# Altium schematic sheet BOOST.SchDoc
size A4; SheetNumber: 4; SheetTotal: 5
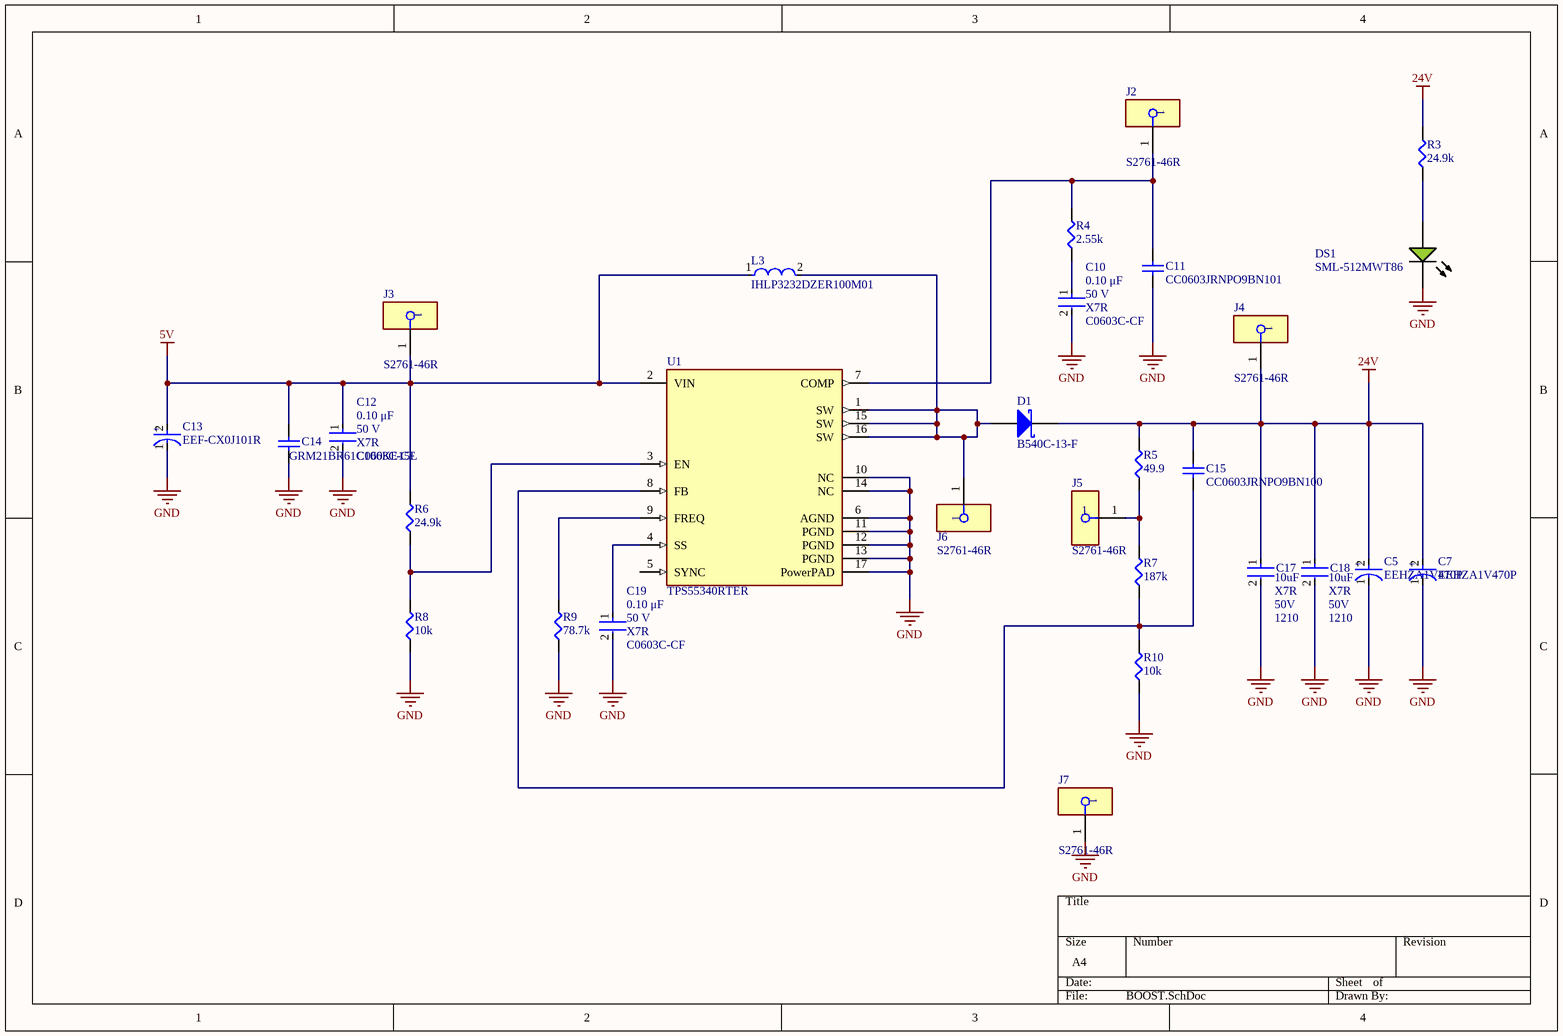
[diagram p0: BOOST.SchDoc]

## Parts
C5  EEHZA1V470P  [FP-EEH-D-MFG]
C7  EEHZA1V470P  [FP-EEH-D-MFG]
C10  value 0.10 μF  Package: C0603C-CF  Voltage Rating: 50 V  Temperature Characteristic: X7R  [FP-C0603C-CF-MFG]  (hidden comment: C0603C104K5RACTU)
C11  CC0603JRNPO9BN101  [CAPC1608X90X40ML10T20]
C12  value 0.10 μF  Package: C0603C-CF  Voltage Rating: 50 V  Temperature Characteristic: X7R  [FP-C0603C-CF-MFG]  (hidden comment: C0603C104K5RACTU)
C13  EEF-CX0J101R  [FP-CX-MFG]
C14  GRM21BR61C106KE15L  [CAPC2013X135X50LL10T20]
C15  CC0603JRNPO9BN100  [CAPC1608X90X40ML10T20]
C17  Capacitance: 10uF  Dielectric: X7R  Voltage Rating (DC): 50V  Case Code (Imperial): 1210  [FP-CL32-IPC_C]  (hidden comment: CL32B106KBJNNNE)
C18  Capacitance: 10uF  Dielectric: X7R  Voltage Rating (DC): 50V  Case Code (Imperial): 1210  [FP-CL32-IPC_C]  (hidden comment: CL32B106KBJNNNE)
C19  value 0.10 μF  Package: C0603C-CF  Voltage Rating: 50 V  Temperature Characteristic: X7R  [FP-C0603C-CF-MFG]  (hidden comment: C0603C104K5RACTU)
D1  B540C-13-F  [DIOD-B5X0C-2_L]
DS1  SML-512MWT86  [ROHM-SML-51X_V]
J2  S2761-46R  [FP-S2761-46R-MFG]
J3  S2761-46R  [FP-S2761-46R-MFG]
J4  S2761-46R  [FP-S2761-46R-MFG]
J5  S2761-46R  [FP-S2761-46R-MFG]
J6  S2761-46R  [FP-S2761-46R-MFG]
J7  S2761-46R  [FP-S2761-46R-MFG]
L3  IHLP3232DZER100M01  [FP-IHLP-3232DZ-FP_2_413x5-MFG]
R3  24.9k  [SMD-0603-RES]
R4  2.55k  [SMD-0603-RES]
R5  49.9  [SMD-0603-RES]
R6  24.9k  [SMD-0603-RES]
R7  187k  [SMD-0603-RES]
R8  10k  [SMD-0603-RES]
R9  78.7k  [SMD-0603-RES]
R10  10k  [SMD-0603-RES]
U1  TPS55340RTER  [FP-RTE0016C-IPC_A]

## Nets
5V: C12.1 C13.2(A) C14.2 J3.1 L3.1 R6.2 U1.2(VIN)
24V: C5.2(A) C7.2(A) C15.1 C17.1 C18.1 D1.1(K) J4.1 R3.2 R5.2
GND: C5.1(C) C7.1(C) C10.2 C11.1 C12.2 C13.1(C) C14.1 C17.2 C18.2 C19.2 DS1.2(K) J7.1 R8.1 R9.1 R10.1 U1.6(AGND) U1.10(NC) U1.11(PGND) U1.12(PGND) U1.13(PGND) U1.14(NC) U1.17(PowerPAD)
NetC10_1: C10.1 R4.1
NetC11_2: C11.2 J2.1 R4.2 U1.7(COMP)
NetC15_2: C15.2 R7.1 R10.2 U1.8(FB)
NetC19_1: C19.1 U1.4(SS)
NetD1_2: D1.2(A) J6.1 L3.2 U1.1(SW) U1.15(SW) U1.16(SW)
NetDS1_1: DS1.1(A) R3.1
NetJ5_1: J5.1 R5.1 R7.2
NetR6_1: R6.1 R8.2 U1.3(EN)
NetR9_2: R9.2 U1.9(FREQ)

Not connected (* = marked no-connect by the designer): U1 5(SYNC)

## Notes on the sheet
- (in symbol CMP-05427-000056-1) +
- (in symbol CMP-05428-000653-1) +

## Library data of the parts
C5 C7 = CMP-05428-000653-1: Aluminum Hybrid Polymer Capacitors 47uF 20% 35V Life 10000Hours AEC-Q200 RADIAL SMT
C10 C12 C19 = CMP-2006-03061-2: CAP CER 0.1UF 50V X7R 0603; Manufacturer: KEMET; Tolerance: 0.1; Temperature Coefficient: 30ppm/°C; Material: Ceramic; Automotive Grade: Grade 1; Temperature: -55°C to +125°C; RoHS: TRUE; Temperature Range High: +125°C; Lead Free: Yes; Octopart: https://octopart.com/c0603c104k5ractu-kemet-139244; Digikey Description: CAP CER 0.1UF 50V X7R 0603; Category: Cap; ComponentLink2Description: Datasheet; Temperature Range Low: -55°C; Device Class L1: Passive Components; Automotive: Yes; Device Class L3: Ceramic Capacitors; ComponentLink2URL: https://api.kemet.com/component-edge/download/datasheet/C0603C100J5GACAUTO.pdf; Capacitance: 0.10 μF; Device Class L2: Capacitors; Manufacturer Part Number: C0603C104K5RACTU; Height: 0.87mm
C11 = CMP-2100-03594-1: Chip Capacitor, 100 pF, +/- 5%, 50 V, -55 to 125 degC, 0603 (1608 Metric), RoHS, Tape and Reel; Manufacturer: Yageo; Capacitance: 100pF; Voltage Rating (DC): 50V; Dielectric: C0G; Temperature Coefficient: 30ppm/degC; Insulation Resistance: 100GR; Datasheet Version: Rev. 14, 07/2016; Manufacturer URL: http://www.yageo.com/; Packaging: TapeandReel; Mount: SurfaceMount; RoHSCompliant: True; Package Reference: 0603; Tolerance: 5%; Max Operating Temperature: 125degC; Case Code (Imperial): 0603; Number of Pins: 2; Width: 0.8mm; Case Code (Metric): 1608; Voltage: 50V; REACH SVHC: Unknown; Package Description: 2-Pin Surface Mount Device, Body 1.6 x 0.8 mm; Composition: Ceramic; Lead Free: LeadFree; Min Operating Temperature: -55degC; Radiation Hardening: No; Depth: 0.8mm; Thickness: 0.035inch; Datasheet URL: http://www.yageo.com/documents/recent/UPY-GP_NP0_16V-to-50V_14.pdf; Termination: SMD/SMT; Package Quantity: 1; Length: 1.6mm; Voltage Rating: 50V; Height: 0.8mm; Case/Package: 0603
C13 = CMP-05427-000056-1: CAP ALUM POLY 100UF 20% 6.3V SMD; Ripple Current: 2.7A; Polarity: Polar; Leakage Current: 63uA; Lead Diameter: 2.4mm; Life (Hours): 1000Hour; ESR (Equivalent Series Resistance): 15mR; Dissipation Factor: 0.06%; Voltage Rating (DC): 6.3V; Height: 1.9mm; Construction: Flat; Length: 7.3mm; Voltage: 6.3V; Package Quantity: 3500; Width: 0.169inch; REACH SVHC: No SVHC; Number of Pins: 2; Radiation Hardening: No; Voltage Rating: 6.3V; Termination: SMD/SMT; Max Operating Temperature: 105°C; Height - Seated (Max): 0.075inch; Tolerance: 20%; Lead Pitch: 1.3mm; Series: SP-Cap CX; Capacitance: 100uF; Min Operating Temperature: -40°C; Case Code (Metric): 7343; Mount: Surface Mount; Weight: 0.004586oz; Depth: 4.3mm; Packaging: Tape and Reel; RoHS Compliant: Yes; Lead Free: Lead Free; Ripple Current (AC): 2.7A; Case Code (Imperial): 2917; Case/Package: 2917
C14 = CMP-2007-03453-1: Manufacturer: Murata; Part Number: GRM21BR61C106KE15L
C15 = CMP-2100-03593-1: Chip Capacitor, 10 pF, +/- 5%, 50 V, -55 to 125 degC, 0603 (1608 Metric), RoHS, Tape and Reel; Manufacturer: Yageo; Insulation Resistance: 100GR; Voltage Rating: 50V; Temperature Coefficient: 30ppm/degC; Dielectric: C0G; Capacitance: 10pF; Radiation Hardening: No; Mount: SurfaceMount; Width: 0.031inch; Composition: Ceramic; Package Description: 2-Pin Surface Mount Device, Body 1.6 x 0.8 mm; Min Operating Temperature: -55degC; Case Code (Metric): 1608; Datasheet URL: http://www.yageo.com/documents/recent/UPY-GP_NP0_16V-to-50V_14.pdf; Termination: SMD/SMT; REACH SVHC: NoSVHC; Case/Package: 0603; RoHSCompliant: True; Packaging: TapeandReel; Max Operating Temperature: 125degC; Voltage: 50V; Package Quantity: 1; Manufacturer URL: http://www.yageo.com/; Tolerance: 5%; Height: 0.8mm; Depth: 0.8mm; Thickness: 0.035inch; Case Code (Imperial): 0603; Length: 1.6mm; Package Reference: 0603; Voltage Rating (DC): 50V; Lead Free: LeadFree; Number of Pins: 2; Datasheet Version: Rev. 14, 07/2016
C17 C18 = CMP-2000-06110-2: Cap Ceramic 10uF 50V X7R ±10% SMD 1210 +125°C Embossed T/R; Material: Ceramic; Min Operating Temperature: -55°C; Depth: 2.5mm; Radiation Hardening: No; Packaging: Tape and Reel; Case Code (Metric): 3225; Height: 2.5mm; Thickness: 0.106inch; Voltage Rating: 50V; Width: 0.098inch; Length: 3.2mm; Tolerance: 10%; Lead Free: Lead Free; Package Quantity: 1; Voltage: 50V; Mount: Surface Mount; Case/Package: 1210; Max Operating Temperature: 125°C
D1 = CMP-2000-05097-2: Schottky Barrier Rectifier, 5 A, 40 V, -55 to 125 degC, 2-Pin SMD, RoHS, Tape and Reel; Configuration: Single; Vf - Forward Voltage: 0.55V; If - Forward Current: 5A; Ifsm - Forward Surge Current: 100A; Ir - Reverse Current: 500uA; Unit Weight: 0.007408oz; Brand: DiodesIncorporated; Vrrm - Repetitive Reverse Voltage: 40V; Operating Temperature Range: -55Cto+125C; Manufacturer URL: http://www.diodes.com/; RoHS: True; Mounting Style: SMD/SMT; Product Category: SchottkyDiodes&Rectifiers; Factory Pack Quantity: 3000; Datasheet Version: Rev. 14-2, 09/2010; Product: SchottkyDiodes; Width: 6.22mm; Maximum Operating Temperature: +125C; Datasheet URL: https://datasheet.ciiva.com/26788/b540c-13-f-26788854.pdf; Height: 2.5mm; Technology: Si; Minimum Operating Temperature: -55C; Type: SchottkyBarrierRectifier; Packaging: Reel; Length: 7.11mm; Series: B540C; Package / Case: SMC; Termination Style: SMD/SMT; Manufacturer: DiodesIncorporated
DS1 = CMP-2000-07117-1: Yellow Green LED, 2.1 V, 20 mA, -30 to 85 degC, 2-Pin SMD, RoHS, Tape and Reel; Manufacturer: Rohm; Forward Voltage: 2.1V; Intensity: 40mcd; Forward (Drive) Current: 20mA; Lens Type: Diffused; Dimension: 0603; Package Reference: SML-51X; Package Description: 2-Pin Surface Mount Device, Body 1.6 x 0.8 mm; Datasheet URL: http://media.digikey.com/pdf/Data%20Sheets/Rohm%20PDFs/SML-51_Series.pdf; Manufacturer URL: http://www.rohm.com/web/global/; Datasheet Version: Rev. B, 05/2011; Color: Green; Mounting Technology: SurfaceMount
J2-J7 = CMP-15817-000011-1: PC TEST POINT NATURAL; Body Material: Brass; Plating: Tin; Mount: Surface Mount; Material: Copper Alloy; Packaging: Tape and Reel; Color: Natural; RoHS Compliant: Yes
L3 = CMP-02424-000288-1: FIXED IND 10UH 5.2A 59.9 MOHM; Inductance Tolerance: 20%; Core Material: Metal; Saturation Current: 9A; Self Resonant Frequency: 15MHz; Shielding: Shielded; Test Frequency: 100kHz; DC Resistance (DCR): 59.9mR; Radiation Hardening: No; Termination: SMD/SMT; Height - Seated (Max): 0.157inch; Height: 4mm; Lead Free: Lead Free; Min Operating Temperature: -55°C; Width: 0.322inch; Package Quantity: 500; Military Standard: Not; Length: 8.64mm; RMS Current (Irms): 5.2A; Mount: Surface Mount; Current Rating: 5.2A; Max Operating Temperature: 125°C; Number of Pins: 2; Inductance: 10uH; Depth: 8.26mm; Packaging: Tape and Reel; Max DC Current: 5.2A; Case/Package: 3232; Tolerance: 20%
R3 R6 = ERJ-3EKF2492V: RES SMD 24.9K OHM 1% 1/10W 0603; Manufacturer: Panasonic Electronic Components; Factory Stock: 0; Unit Price (USD): 0.00379; @ qty: 1500; Minimum Quantity: 1; Power (Watts): 0.1W, 1/10W; Temperature Coefficient: ±100ppm/°C; Part Number: ERJ-3EKF2492V; Datasheets: http://industrial.panasonic.com/www-cgi/jvcr13pz.cgi?E+PZ+3+AOA0002+ERJ3EKF2492V+7+WW; Image: //media.digikey.com/Photos/Panasonic%20Photos/MFG_ERJ-P6W%20Series.jpg; Digi-Key Part Number: P24.9KHCT-ND; Quantity Available: 280905; Packaging: Cut Tape (CT); Series: ERJ; Part Status: Active; Value: 24.9k; Tolerance: ±1%; Composition: Thick Film; Features: Automotive AEC-Q200; Operating Temperature: -55°C ~ 155°C; Package / Case: 0603 (1608 Metric); Supplier Device Package: 0603; Size / Dimension: 0.063" L x 0.031" W (1.60mm x 0.80mm); Height - Seated (Max): 0.022" (0.55mm); Number of Terminations: 2; Failure Rate: -
R4 = ERJ-3EKF2551V: RES SMD 2.55K OHM 1% 1/10W 0603; Manufacturer: Panasonic Electronic Components; Factory Stock: 0; Unit Price (USD): 0.00379; @ qty: 1500; Minimum Quantity: 1; Power (Watts): 0.1W, 1/10W; Temperature Coefficient: ±100ppm/°C; Part Number: ERJ-3EKF2551V; Datasheets: http://industrial.panasonic.com/www-cgi/jvcr13pz.cgi?E+PZ+3+AOA0002+ERJ3EKF2551V+7+WW; Image: //media.digikey.com/Photos/Panasonic%20Photos/MFG_ERJ-P6W%20Series.jpg; Digi-Key Part Number: P2.55KHCT-ND; Quantity Available: 27493; Packaging: Cut Tape (CT); Series: ERJ; Part Status: Active; Value: 2.55k; Tolerance: ±1%; Composition: Thick Film; Features: Automotive AEC-Q200; Operating Temperature: -55°C ~ 155°C; Package / Case: 0603 (1608 Metric); Supplier Device Package: 0603; Size / Dimension: 0.063" L x 0.031" W (1.60mm x 0.80mm); Height - Seated (Max): 0.022" (0.55mm); Number of Terminations: 2; Failure Rate: -
R5 = ERJ-3EKF49R9V: RES SMD 49.9 OHM 1% 1/10W 0603; Manufacturer: Panasonic Electronic Components; Factory Stock: 0; Unit Price (USD): 0.00379; @ qty: 1500; Minimum Quantity: 1; Power (Watts): 0.1W, 1/10W; Temperature Coefficient: ±100ppm/°C; Part Number: ERJ-3EKF49R9V; Datasheets: http://industrial.panasonic.com/www-cgi/jvcr13pz.cgi?E+PZ+3+AOA0002+ERJ3EKF49R9V+7+WW; Image: //media.digikey.com/Photos/Panasonic%20Photos/MFG_ERJ-P6W%20Series.jpg; Digi-Key Part Number: P49.9HCT-ND; Quantity Available: 566023; Packaging: Cut Tape (CT); Series: ERJ; Part Status: Active; Value: 49.9; Tolerance: ±1%; Composition: Thick Film; Features: Automotive AEC-Q200; Operating Temperature: -55°C ~ 155°C; Package / Case: 0603 (1608 Metric); Supplier Device Package: 0603; Size / Dimension: 0.063" L x 0.031" W (1.60mm x 0.80mm); Height - Seated (Max): 0.022" (0.55mm); Number of Terminations: 2; Failure Rate: -
R7 = ERJ-3EKF1873V: RES SMD 187K OHM 1% 1/10W 0603; Manufacturer: Panasonic Electronic Components; Factory Stock: 0; Unit Price (USD): 0.00379; @ qty: 1500; Minimum Quantity: 1; Power (Watts): 0.1W, 1/10W; Temperature Coefficient: ±100ppm/°C; Part Number: ERJ-3EKF1873V; Datasheets: http://industrial.panasonic.com/www-cgi/jvcr13pz.cgi?E+PZ+3+AOA0002+ERJ3EKF1873V+7+WW; Image: //media.digikey.com/Photos/Panasonic%20Photos/MFG_ERJ-P6W%20Series.jpg; Digi-Key Part Number: P187KHCT-ND; Quantity Available: 86417; Packaging: Cut Tape (CT); Series: ERJ; Part Status: Active; Value: 187k; Tolerance: ±1%; Composition: Thick Film; Features: Automotive AEC-Q200; Operating Temperature: -55°C ~ 155°C; Package / Case: 0603 (1608 Metric); Supplier Device Package: 0603; Size / Dimension: 0.063" L x 0.031" W (1.60mm x 0.80mm); Height - Seated (Max): 0.022" (0.55mm); Number of Terminations: 2; Failure Rate: -
R8 R10 = ERJ-3EKF1002V: RES SMD 10K OHM 1% 1/10W 0603; Manufacturer: Panasonic Electronic Components; Factory Stock: 0; Unit Price (USD): 0.00379; @ qty: 1500; Minimum Quantity: 1; Power (Watts): 0.1W, 1/10W; Temperature Coefficient: ±100ppm/°C; Part Number: ERJ-3EKF1002V; Datasheets: http://industrial.panasonic.com/www-cgi/jvcr13pz.cgi?E+PZ+3+AOA0002+ERJ3EKF1002V+7+WW; Image: //media.digikey.com/Photos/Panasonic%20Photos/MFG_ERJ-P6W%20Series.jpg; Digi-Key Part Number: P10.0KHCT-ND; Quantity Available: 6703141; Packaging: Cut Tape (CT); Series: ERJ; Part Status: Active; Value: 10k; Tolerance: ±1%; Composition: Thick Film; Features: Automotive AEC-Q200; Operating Temperature: -55°C ~ 155°C; Package / Case: 0603 (1608 Metric); Supplier Device Package: 0603; Size / Dimension: 0.063" L x 0.031" W (1.60mm x 0.80mm); Height - Seated (Max): 0.022" (0.55mm); Number of Terminations: 2; Failure Rate: -
R9 = ERJ-3EKF7872V: RES SMD 78.7K OHM 1% 1/10W 0603; Manufacturer: Panasonic Electronic Components; Factory Stock: 0; Unit Price (USD): 0.00379; @ qty: 1500; Minimum Quantity: 1; Power (Watts): 0.1W, 1/10W; Temperature Coefficient: ±100ppm/°C; Part Number: ERJ-3EKF7872V; Datasheets: http://industrial.panasonic.com/www-cgi/jvcr13pz.cgi?E+PZ+3+AOA0002+ERJ3EKF7872V+7+WW; Image: //media.digikey.com/Photos/Panasonic%20Photos/MFG_ERJ-P6W%20Series.jpg; Digi-Key Part Number: P78.7KHCT-ND; Quantity Available: 129417; Packaging: Cut Tape (CT); Series: ERJ; Part Status: Active; Value: 78.7k; Tolerance: ±1%; Composition: Thick Film; Features: Automotive AEC-Q200; Operating Temperature: -55°C ~ 155°C; Package / Case: 0603 (1608 Metric); Supplier Device Package: 0603; Size / Dimension: 0.063" L x 0.031" W (1.60mm x 0.80mm); Height - Seated (Max): 0.022" (0.55mm); Number of Terminations: 2; Failure Rate: -
U1 = CMP-04918-000344-1: IC REG BOOST ADJ 5.25A 16WQFN; Switching Frequency: 1.14MHz; Max Input Voltage: 32V; Max Output Voltage: 38V; Number of Outputs: 1; Output Current: 5A; Synchronous Rectifier: No; Min Output Voltage: 2.9V; Output Type: Adjustable; Quiescent Current: 500uA; Min Operating Temperature: -40°C; Mount: Surface Mount; Contact Plating: Gold; Topology: Boost; Package Quantity: 3000; Output Voltage: 38V; RoHS Compliant: Yes; Lead Free: Lead Free; Min Input Voltage: 2.9V; Packaging: Tape and Reel; Max Operating Temperature: 150°C; Series: -; Max Output Current: 5A; REACH SVHC: No SVHC; Number of Pins: 16